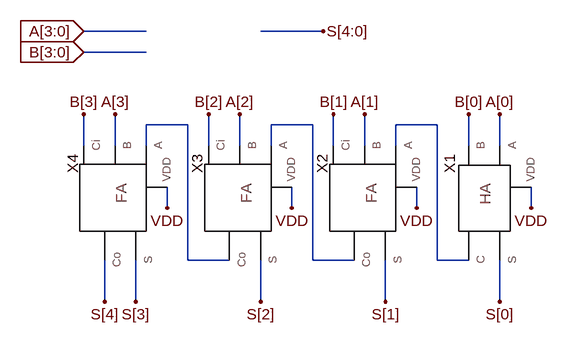
[diagram p0: schematic RCA4bit.asc]
RCA4bit.asc, the LTspice schematic file:
Version 4
SHEET 1 880 680
WIRE -224 -256 -320 -256
WIRE 48 -256 -48 -256
WIRE -224 -224 -320 -224
WIRE -160 -112 -224 -112
WIRE 32 -112 -32 -112
WIRE 224 -112 160 -112
WIRE -320 -80 -320 -128
WIRE -272 -80 -272 -128
WIRE -224 -80 -224 -112
WIRE -128 -80 -128 -128
WIRE -80 -80 -80 -128
WIRE -32 -80 -32 -112
WIRE 64 -80 64 -128
WIRE 112 -80 112 -128
WIRE 160 -80 160 -112
WIRE 272 -80 272 -128
WIRE 320 -80 320 -128
WIRE -192 16 -192 -16
WIRE 0 16 0 -16
WIRE 192 16 192 -16
WIRE 368 16 368 -16
WIRE -160 96 -160 -112
WIRE -96 96 -160 96
WIRE 32 96 32 -112
WIRE 96 96 32 96
WIRE 224 96 224 -112
WIRE 272 96 224 96
WIRE -288 160 -288 96
WIRE -240 160 -240 96
WIRE -48 160 -48 96
WIRE 144 160 144 96
WIRE 320 160 320 96
FLAG 320 160 S[0]
FLAG 192 16 VDD
FLAG 368 16 VDD
FLAG 0 16 VDD
FLAG -192 16 VDD
FLAG 144 160 S[1]
FLAG -48 160 S[2]
FLAG -240 160 S[3]
FLAG -288 160 S[4]
FLAG 320 -128 A[0]
FLAG 272 -128 B[0]
FLAG 112 -128 A[1]
FLAG 64 -128 B[1]
FLAG -80 -128 A[2]
FLAG -128 -128 B[2]
FLAG -272 -128 A[3]
FLAG -320 -128 B[3]
FLAG -320 -224 B[3:0]
IOPIN -320 -224 In
FLAG -320 -256 A[3:0]
IOPIN -320 -256 In
FLAG 48 -256 S[4:0]
SYMBOL HA 320 -16 R90
SYMATTR InstName X1
SYMBOL FA 144 -16 R90
SYMATTR InstName X2
SYMBOL FA -48 -16 R90
SYMATTR InstName X3
SYMBOL FA -240 -16 R90
SYMATTR InstName X4

The netlist it stands for:
* RCA4bit.asc
XX1 A[0] B[0] VDD S[0] N003 HA  ; pins A B VDD S C
XX2 N003 A[1] VDD S[1] N002 B[1] FA  ; pins A B VDD S Co Ci
XX3 N002 A[2] VDD S[2] N001 B[2] FA  ; pins A B VDD S Co Ci
XX4 N001 A[3] VDD S[3] S[4] B[3] FA  ; pins A B VDD S Co Ci
.backanno
.end